# Altium schematic sheet AI-EYE.SchDoc
size A3; SheetNumber: 1; SheetTotal: 1
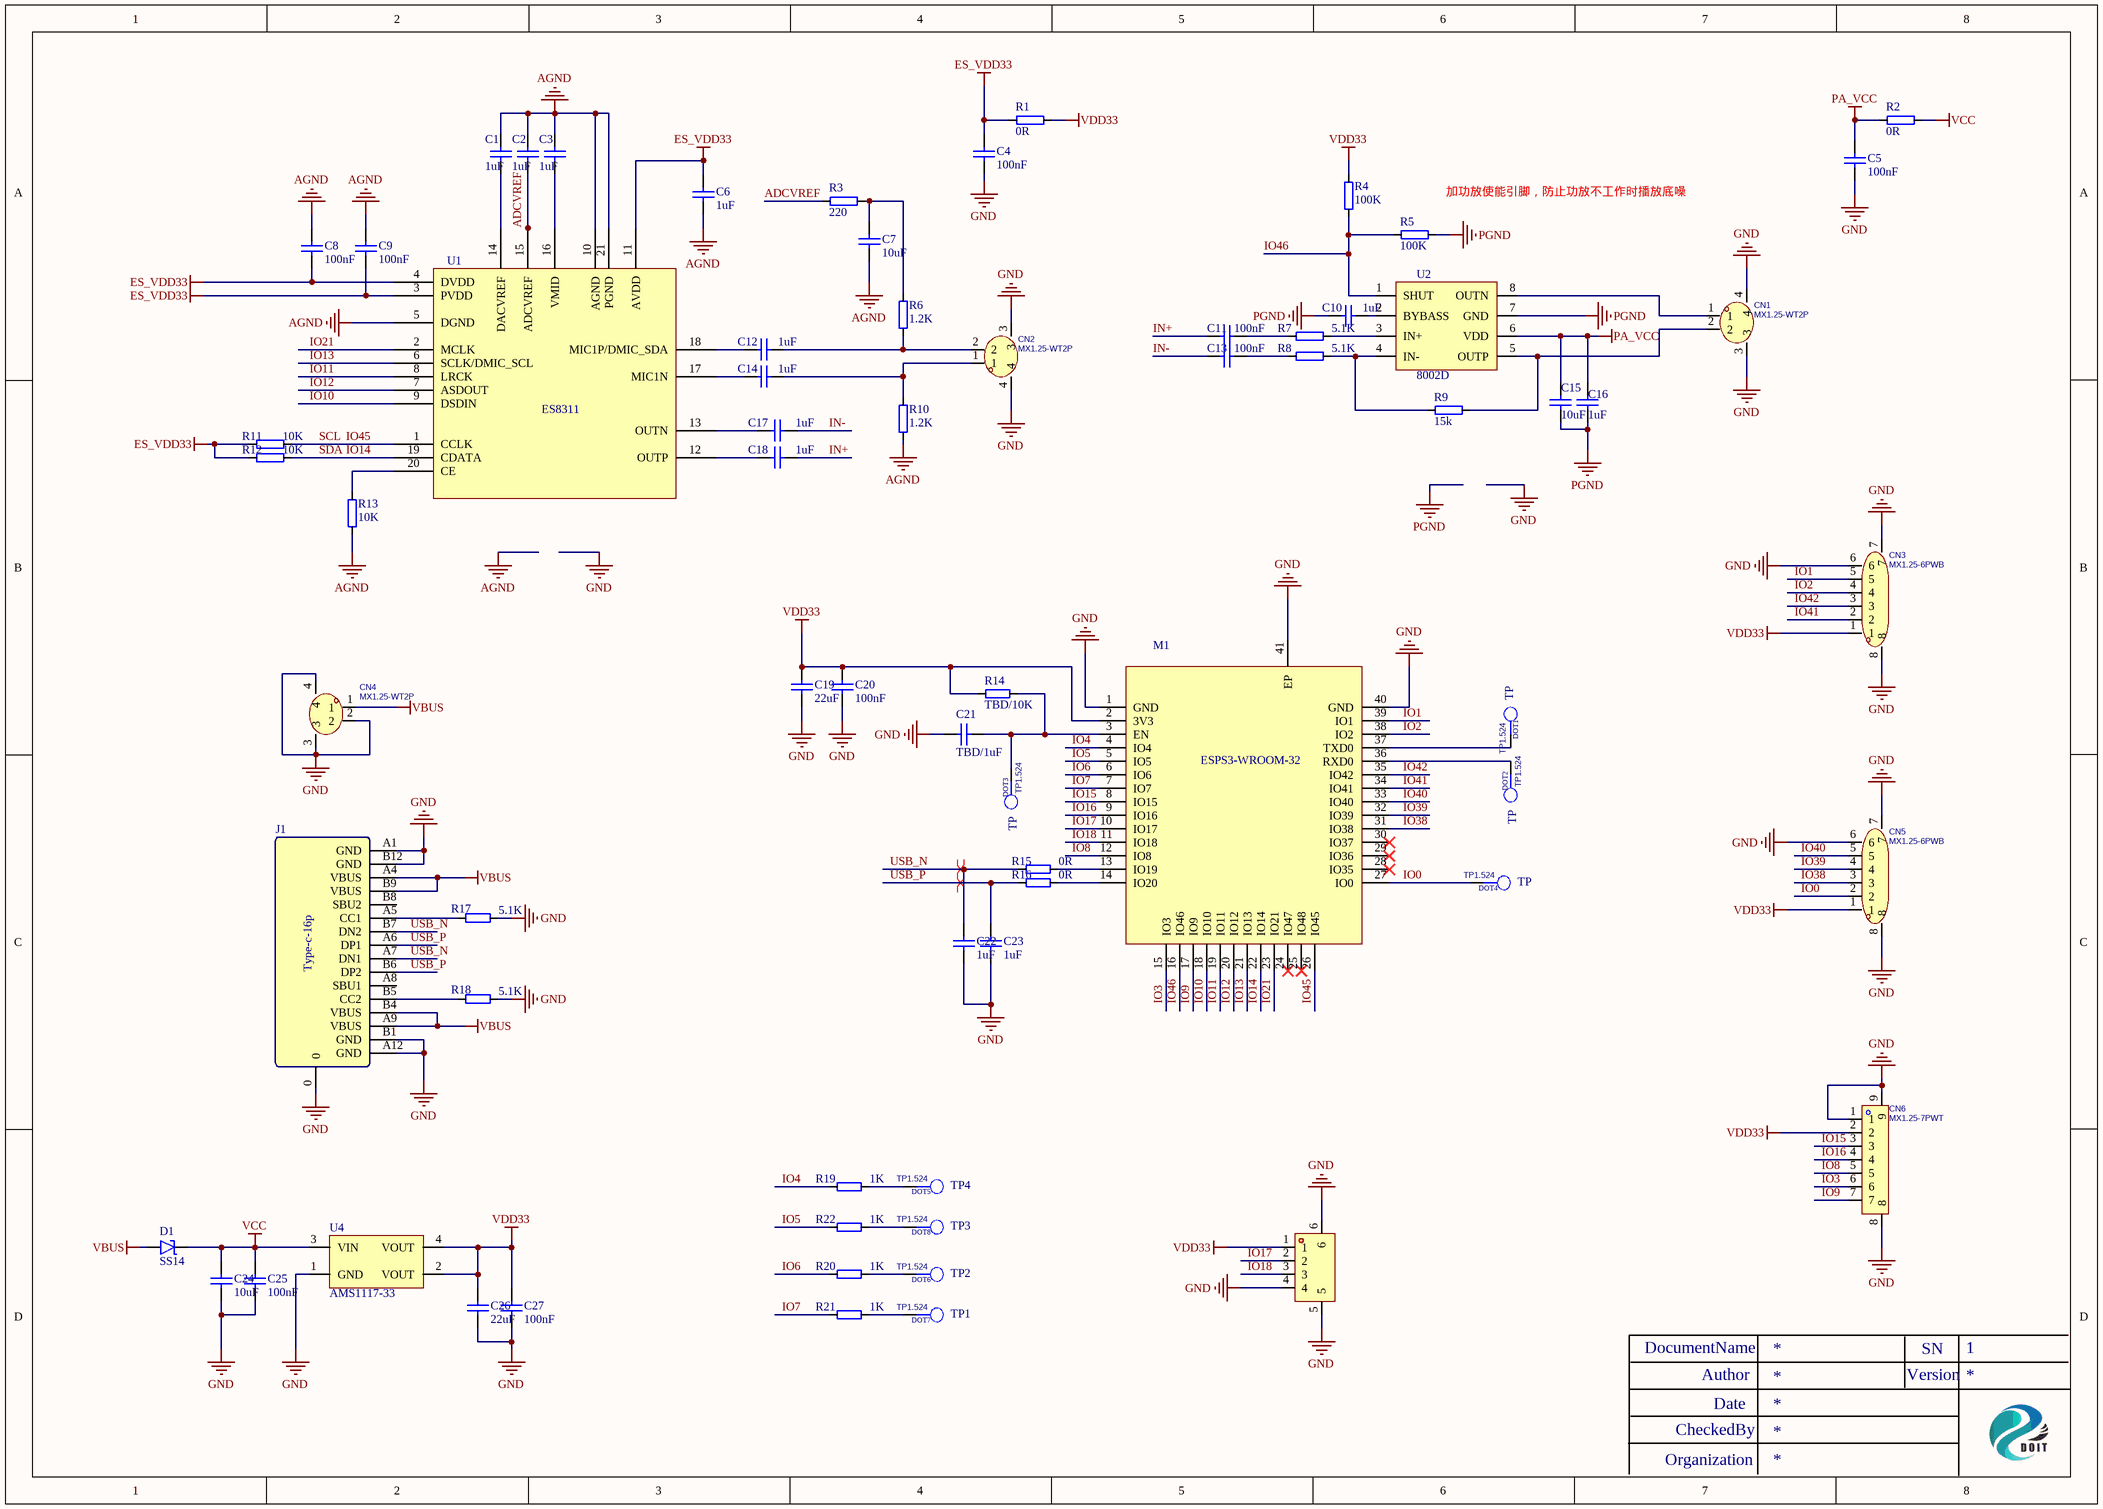
[diagram p0: AI-EYE.SchDoc]

## Parts
C1  1uF  [0402C]
C2  1uF  [0402C]
C3  1uF  [0402C]
C4  100nF  [0402C]
C5  100nF  [0402C]
C6  1uF  [0402C]
C7  10uF  [0402C]
C8  100nF  [0402C]
C9  100nF  [0402C]
C10  1uF  [0402C]
C11  100nF  [0402C]
C12  1uF  [0402C]
C13  100nF  [0402C]
C14  1uF  [0402C]
C15  10uF  [0402C]
C16  1uF  [0402C]
C17  1uF  [0402C]
C18  1uF  [0402C]
C19  22uF  [0603C]
C20  100nF  [0603C]
C21  TBD/1uF  [0402C]
C22  1uF  [0402C]
C23  1uF  [0402C]
C24  10uF  [0603C]
C25  100nF  [0603C]
C26  22uF  [0603C]
C27  100nF  [0603C]
CN1  MX1.25-WT2P  [CONN-SMD_2P-P1.25-WT2P]
CN2  MX1.25-WT2P  [CONN-SMD_2P-P1.25-WT2P]
CN3  MX1.25-6PWB  [CONN-SMD_6P-P1.25_XUNPU_WAFER-MX1.25-6PWB]
CN4  MX1.25-WT2P  [CONN-SMD_2P-P1.25-WT2P]
CN5  MX1.25-6PWB  [CONN-SMD_6P-P1.25_XUNPU_WAFER-MX1.25-6PWB]
CN6  MX1.25-7PWT  [CONN-SMD_7P-P1.25_MX1.25-7PWT]
D1  SS14  [SOD123]
DOT1  TP  PCB Footprint: TP1.524  [TP-1.524]
DOT2  TP  PCB Footprint: TP1.524  [TP-1.524]
DOT3  TP  PCB Footprint: TP1.524  [TP-1.524]
DOT4  TP  PCB Footprint: TP1.524  [TP-1.524]
DOT5  TP4  PCB Footprint: TP1.524  [TP-5]
DOT6  TP2  PCB Footprint: TP1.524  [TP-5]
DOT7  TP1  PCB Footprint: TP1.524  [TP-5]
DOT8  TP3  PCB Footprint: TP1.524  [TP-5]
J1  Type-c-16p  [USB-TYPE-C]
M1  ESPS3-WROOM-32  [ESPS3-WROOM-32]
R1  0R  [0402R]
R2  0R  [0402R]
R3  220  [0402R]
R4  100K  [0402R]
R5  100K  [0402R]
R6  1.2K  [0402R]
R7  5.1K  [0402R]
R8  5.1K  [0402R]
R9  15k  [0402R]
R10  1.2K  [0402R]
R11  10K  [0402R]
R12  10K  [0402R]
R13  10K  [0402R]
R14  TBD/10K  [0603R]
R15  0R  [0402R]
R16  0R  [0402R]
R17  5.1K  [0402R]
R18  5.1K  [0402R]
R19  1K  [0402R]
R20  1K  [0402R]
R21  1K  [0402R]
R22  1K  [0402R]
U1  ES8311  [QFN-20-3X3]
U2  8002D  [SOP8-1.27*5.4]
U4  AMS1117-33  [SOT-223]
U5  ZX-MX1.25-4PWT  [CONN-SMD_4P-P1.25-MX1.25-4P-WT]  (value not drawn)

## Nets
AGND: C1.2 C2.2 C3.2 C6.1 C7.2 C8.2 C9.2 R10.2 R13.2 U1.5(DGND) U1.10(AGND) U1.21(PGND)
ES_VDD33: C4.2 C6.2 C8.1 C9.1 R1.2 R11.1 R12.1 U1.3(PVDD) U1.4(DVDD) U1.11(AVDD)
GND: C4.1 C5.1 C19.2 C20.2 C21.1 C22.2 C23.2 C24.2 C25.2 C26.2 C27.2 CN1.3 CN1.4 CN2.3 CN2.4 CN3.6 CN3.7 CN3.8 CN4.2 CN4.3 CN4.4 CN5.6 CN5.7 CN5.8 CN6.1 CN6.8 CN6.9 J1.0 J1.A1(GND) J1.A12(GND) J1.B1(GND) J1.B12(GND) M1.1(GND) M1.40(GND) M1.41(EP) R17.1 R18.1 U4.1(GND) U5.4 U5.5 U5.6
PA_VCC: C5.2 C15.1 C16.1 R2.2 U2.6(VDD)
PGND: C10.2 C15.2 C16.2 R5.2 U2.7(GND)
VBUS: CN4.1 D1.1 J1.A4(VBUS) J1.A9(VBUS) J1.B4(VBUS) J1.B9(VBUS)
VCC: C24.1 C25.1 D1.2 R2.1 U4.3(VIN)
VDD33: C19.1 C20.1 C26.1 C27.1 CN3.1 CN5.1 CN6.2 M1.2(3V3) R1.1 R4.1 R14.1 U4.2(VOUT) U4.4(VOUT) U5.1
ADCVREF: C2.1 R3.2 U1.15(ADCVREF)
IN+: C11.2 C18.1
IN-: C13.2 C17.1
IO0: CN5.2 DOT4.1 M1.27(IO0)
IO1: CN3.5 M1.39(IO1)
IO2: CN3.4 M1.38(IO2)
IO3: CN6.6 M1.15(IO3)
IO4: M1.4(IO4) R19.2
IO5: M1.5(IO5) R22.2
IO6: M1.6(IO6) R20.2
IO7: M1.7(IO7) R21.2
IO8: CN6.5 M1.12(IO8)
IO9: CN6.7 M1.17(IO9)
IO10: M1.18(IO10) U1.9(DSDIN)
IO11: M1.19(IO11) U1.8(LRCK)
IO12: M1.20(IO12) U1.7(ASDOUT)
IO13: M1.21(IO13) U1.6(SCLK/DMIC_SCL)
IO14: M1.22(IO14) R12.2 U1.19(CDATA)  [also labelled SDA]
IO15: CN6.3 M1.8(IO15)
IO16: CN6.4 M1.9(IO16)
IO17: M1.10(IO17) U5.2
IO18: M1.11(IO18) U5.3
IO21: M1.23(IO21) U1.2(MCLK)
IO38: CN5.3 M1.31(IO38)
IO39: CN5.4 M1.32(IO39)
IO40: CN5.5 M1.33(IO40)
IO41: CN3.2 M1.34(IO41)
IO42: CN3.3 M1.35(IO42)
IO45: M1.26(IO45) R11.2 U1.1(CCLK)  [also labelled SCL]
IO46: M1.16(IO46) R4.2 R5.1 U2.1(SHUT)
USB_N: C22.1 J1.A7(DN1) J1.B7(DN2) R15.2
USB_P: C23.1 J1.A6(DP1) J1.B6(DP2) R16.2
NetC1_1: C1.1 U1.14(DACVREF)
NetC3_1: C3.1 U1.16(VMID)
NetC7_1: C7.1 R3.1 R6.2
NetC10_1: C10.1 U2.2(BYBASS)
NetC11_1: C11.1 R7.2
NetC12_1: C12.1 CN2.2 R6.1
NetC12_2: C12.2 U1.18(MIC1P/DMIC_SDA)
NetC13_1: C13.1 R8.2
NetC14_1: C14.1 CN2.1 R10.1
NetC14_2: C14.2 U1.17(MIC1N)
NetC17_2: C17.2 U1.13(OUTN)
NetC18_2: C18.2 U1.12(OUTP)
NetC21_2: C21.2 DOT3.1 M1.3(EN) R14.2
NetCN1_1: CN1.1 U2.8(OUTN)
NetCN1_2: CN1.2 R9.2 U2.5(OUTP)
NetDOT1_1: DOT1.1 M1.37(TXD0)
NetDOT2_1: DOT2.1 M1.36(RXD0)
NetDOT5_1: DOT5.1 R19.1
NetDOT6_1: DOT6.1 R20.1
NetDOT7_1: DOT7.1 R21.1
NetDOT8_1: DOT8.1 R22.1
NetJ1_A5: J1.A5(CC1) R17.2
NetJ1_B5: J1.B5(CC2) R18.2
NetM1_13: M1.13(IO19) R15.1
NetM1_14: M1.14(IO20) R16.1
NetR7_1: R7.1 U2.3(IN+)
NetR8_1: R8.1 R9.1 U2.4(IN-)
NetR13_1: R13.1 U1.20(CE)

Not connected (* = marked no-connect by the designer): J1 A8(SBU1) B8(SBU2); M1 24(IO47)* 25(IO48)* 28(IO35)* 29(IO36)* 30(IO37)*

## Layout directives
differential pair: USB_N, USB_P

## Notes on the sheet
- (near R5) 加功放使能引脚，防止功放不工作时播放底噪
- DocumentName
- Author
- Version
- SN
- CheckedBy
- Date
- Organization

## Library data of the parts
C1-C27 = CAP-SMD
CN1 CN2 CN4 = CONN-MX1.25-2P: Manufacturer: Megastar(兆星); Add into BOM: yes; Pins Structure: 1x2P; Pitch: 2mm; Reference Series: MX; Number of PINs Per Row: 2; Current Rating (Max): 2A; Supplier Part: C7429689; Manufacturer Part: MX1.25-WT2P; Supplier Footprint: SMD,P=2mm,卧贴; JLCPCB Part Class: Extended Part; Convert to PCB: yes; Mounting Style: 卧贴; Number of Pins: 2P; Number of Rows: 1; Row Spacing: -; Contact Material: 黄铜; Contact Plating: 锡; Operating Temperature Range: -25℃~+85℃
CN3 CN5 = CONN-MX1.25-6PWB: Manufacturer: XUNPU(讯普); Symbol: WAFER-MX1.25-6PWB; Add into BOM: yes; Pins Structure: 1x6P; Pitch: 1.25mm; Reference Series: PicoBlade(MX 1.25); Number of PINs Per Row: 6; Current Rating: 1A; Voltage Rating: 125V; Plastic Material: LCP; Supplementary Features: 辅助焊脚; Z-Height of the Board: 3.6mm; X-Length of Bottom Edge on Board (Spacing Line): 12.5mm; Y-Width of Bottom Edge on Board: 5.25mm; Device: WAFER-MX1.25-6PWB; LCSC Part Name: 1x6P 间距:1.25mm 卧贴 系列:PicoBlade(MX 1.25); Supplier Part: C3029363; Manufacturer Part: WAFER-MX1.25-6PWB; Supplier Footprint: SMD,P=1.25mm,卧贴; JLCPCB Part Class: Extended Part; Datasheet: https://atta.szlcsc.com/upload/public/pdf/source/20220527/5ACBB683E384B6AD06743F272F933620.pdf; Supplier: LCSC; Convert to PCB: yes; Mounting Type: 卧贴; Number of Pins: 6P; Number of Rows: 1; Row Spacing: -; Contact Material: 黄铜; Contact Plating: -; Operating Temperature: -25℃~+85℃; Flame Retardant Rating: -; Color: 米色
CN6 = CONN-MX1.25-7PWT: Manufacturer: Bossie(博锡); Symbol: BX-MX1.25-7PWT; Add into BOM: yes; Pins Structure: 1x7P; Pitch: 1.25mm; Reference Series: PicoBlade(MX 1.25); Number of PINs Per Row: 7; Current Rating: 1A; Voltage Rating: 125V; Plastic Material: LCP; Supplementary Features: 辅助焊脚; Z-Height of the Board: 3.6mm; X-Length of Bottom Edge on Board (Spacing Line): 13.75mm; Y-Width of Bottom Edge on Board: 5.25mm; Device: BX-MX1.25-7PWT; LCSC Part Name: 1x7P 间距:1.25mm 卧贴 系列:PicoBlade(MX 1.25); Supplier Part: C19272477; Manufacturer Part: BX-MX1.25-7PWT; Supplier Footprint: SMD,P=1.25mm,卧贴; JLCPCB Part Class: Extended Part; Datasheet: https://atta.szlcsc.com/upload/public/pdf/source/20231201/C3F3F956D9D5AD117E6D1BC59464241C.pdf; Supplier: LCSC; Convert to PCB: yes; Mounting Type: 卧贴; Number of Pins: 7P; Number of Rows: 1; Row Spacing: -; Contact Material: 黄铜; Contact Plating: 锡; Operating Temperature: -25℃~+85℃; Flame Retardant Rating: -; Color: 米色
D1 = D: Schottky diode
DOT5-DOT8 = TP
J1 = USB-TYPE-C
R1-R22 = Res: Resistor
U5 = CONN-MX1.25-4PWT: Manufacturer: Megastar(兆星); Add into BOM: yes; Pins Structure: 1x4P; Pitch: 1.25mm; Reference Series: PicoBlade(MX 1.25); Number of PINs Per Row: 4; Supplementary Features: 辅助焊脚; Z-Height of the Board: 3.6mm; X-Length of Bottom Edge on Board (Spacing Line): 10mm; Y-Width of Bottom Edge on Board: 5.25mm; Symbol: ZX-MX1.25-4PWT; Device: ZX-MX1.25-4PWT; LCSC Part Name: 1x4P 间距:1.25mm 卧贴 系列:PicoBlade(MX 1.25) 配套胶壳型号：ZX-MX1.25-4PJK 配套端子型号：ZX-MX1.25-DZ 配套杜邦线型号：ZX-MX1.25-4PBXC; Supplier Part: C7430470; Manufacturer Part: ZX-MX1.25-4PWT; Supplier Footprint: SMD,P=1.25mm,卧贴; JLCPCB Part Class: Extended Part; Datasheet: https://atta.szlcsc.com/upload/public/pdf/source/20230619/568E7DE8E71AB8D5E62B450F32774D0B.pdf; Supplier: LCSC; Convert to PCB: yes; Mounting Style: 卧贴; Number of Pins: 4P; Number of Rows: 1; Row Spacing: -; Current Rating (Max): -; Contact Material: 黄铜; Contact Plating: 锡; Operating Temperature Range: -; Rated Voltage (Max): -; Plastic Material: -; Flame Retardant Rating: -; Colour: 米色